# EAGLE schematic Shield_Master (EAGLE 9.1.0)
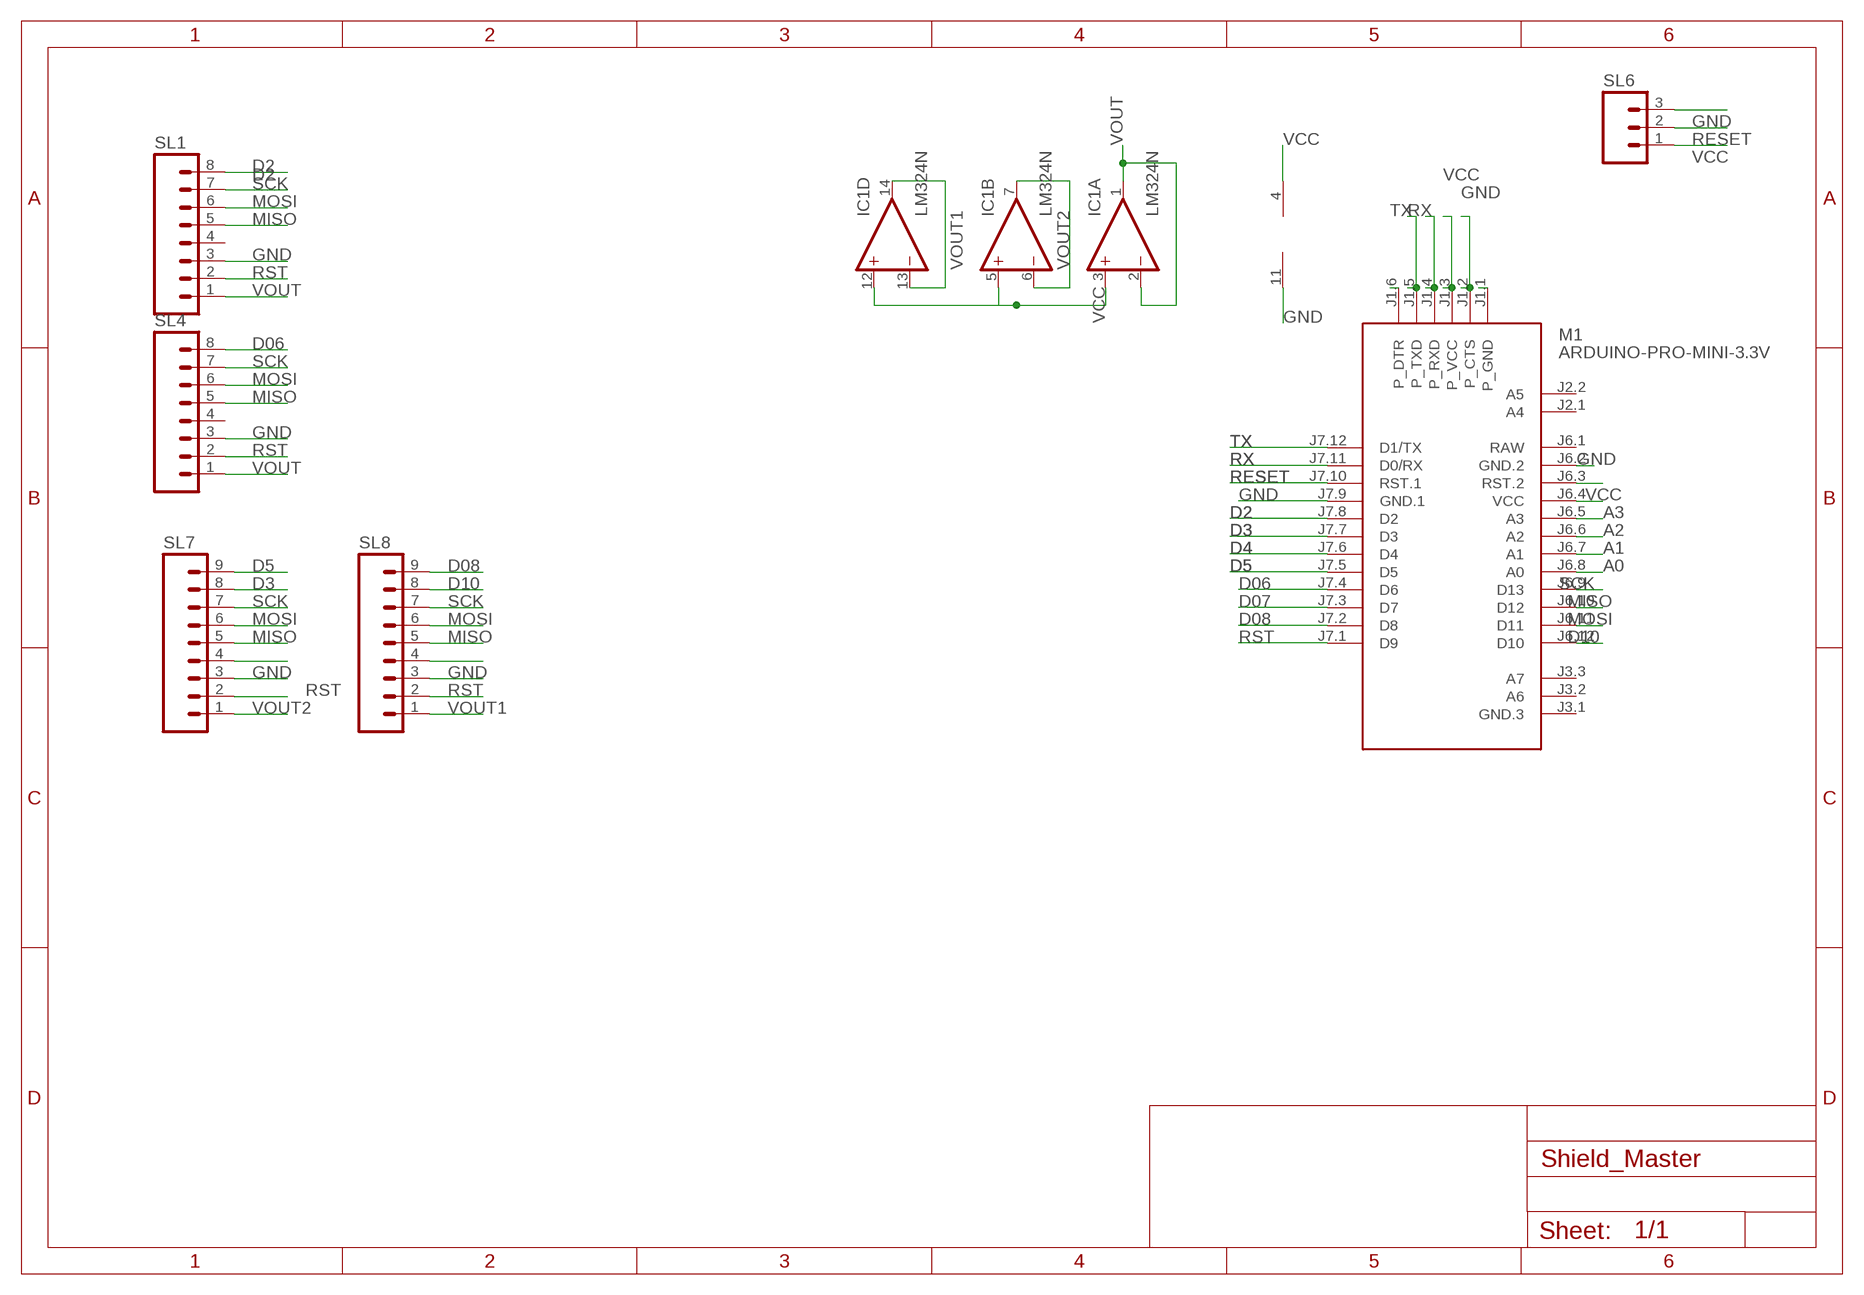
[diagram p0: schematic, sheet 1]

## Parts
IC1  LM324N  [DIL14]
M1  ARDUINO-PRO-MINI-3.3V  [ARDUINO-PRO-MINI]
SL1  M08  [08P]
SL4  M08  [08P]
SL6  M03  [03P]
SL7  M09  [09P]
SL8  M09  [09P]

## Nets
A0: M1.J6.8(A0)
A1: M1.J6.7(A1)
A2: M1.J6.6(A2)
A3: M1.J6.5(A3)
D2: M1.J7.8(D2) SL1.8
D3: M1.J7.7(D3) SL7.8
D4: M1.J7.6(D4)
D5: M1.J7.5(D5) SL7.9
D06: M1.J7.4(D6) SL4.8
D07: M1.J7.3(D7)
D08: M1.J7.2(D8) SL8.9
D10: M1.J6.12(D10) SL8.8
GND: IC1.11(P:V-) M1.J1.2(P_CTS) M1.J6.2(GND.2) M1.J7.9(GND.1) SL1.3 SL4.3 SL6.3 SL7.3 SL8.3
MISO: M1.J6.10(D12) SL1.5 SL4.5 SL7.5 SL8.5
MOSI: M1.J6.11(D11) SL1.6 SL4.6 SL7.6 SL8.6
N$1: M1.J1.6(P_DTR)
N$2: M1.J6.3(RST.2)
N$6: M1.J1.1(P_GND)
N$9: SL7.4
N$19: SL8.4
RESET: M1.J7.10(RST.1) SL6.2
RST: M1.J7.1(D9) SL1.2 SL4.2 SL7.2 SL8.2
RX: M1.J1.4(P_RXD) M1.J7.11(D0/RX)
SCK: M1.J6.9(D13) SL1.7 SL4.7 SL7.7 SL8.7
TX: M1.J1.5(P_TXD) M1.J7.12(D1/TX)
VCC: IC1.3(A:+IN) IC1.4(P:V+) IC1.5(B:+IN) IC1.12(D:+IN) M1.J1.3(P_VCC) M1.J6.4(VCC) SL6.1
VOUT: IC1.1(A:OUT) IC1.2(A:-IN) SL1.1 SL4.1
VOUT1: IC1.13(D:-IN) IC1.14(D:OUT) SL8.1
VOUT2: IC1.6(B:-IN) IC1.7(B:OUT) SL7.1
Unconnected: IC1.8(C:OUT) IC1.9(C:-IN) IC1.10(C:+IN) M1.J2.1(A4) M1.J2.2(A5) M1.J3.1(GND.3) M1.J3.2(A6) M1.J3.3(A7) SL1.4 SL4.4

## Power pins joined to a net without a drawn wire
RAW: M1.J6.1(RAW)

## Library data of the parts
IC1 = linear:LM324: OP AMP
M1 = diy-modules:ARDUINO-PRO-MINI-*: Arduino Pro Mini and compatible devices More details available here: https://www.arduino.cc/en/Main/ArduinoBoardProMini Click here to find device on ebay.com <http://www.ebay.com/sch/arduino+pro+mini>
SL1 SL4 = con-amp-quick:M08: AMP QUICK CONNECTOR; OC_FARNELL: unknown; OC_NEWARK: unknown
SL6 = con-amp-quick:M03: AMP QUICK CONNECTOR; OC_FARNELL: unknown; OC_NEWARK: unknown
SL7 SL8 = con-amp-quick:M09: AMP QUICK CONNECTOR; OC_FARNELL: unknown; OC_NEWARK: unknown